# Altium schematic sheet logi-cam-top.SchDoc: PMOD Camera Adapter
size A; Engineer: Michael Jones; DocumentNumber: 1; Revision: RA.1; SheetNumber: 1; SheetTotal: 2; ProjectName: OV7725
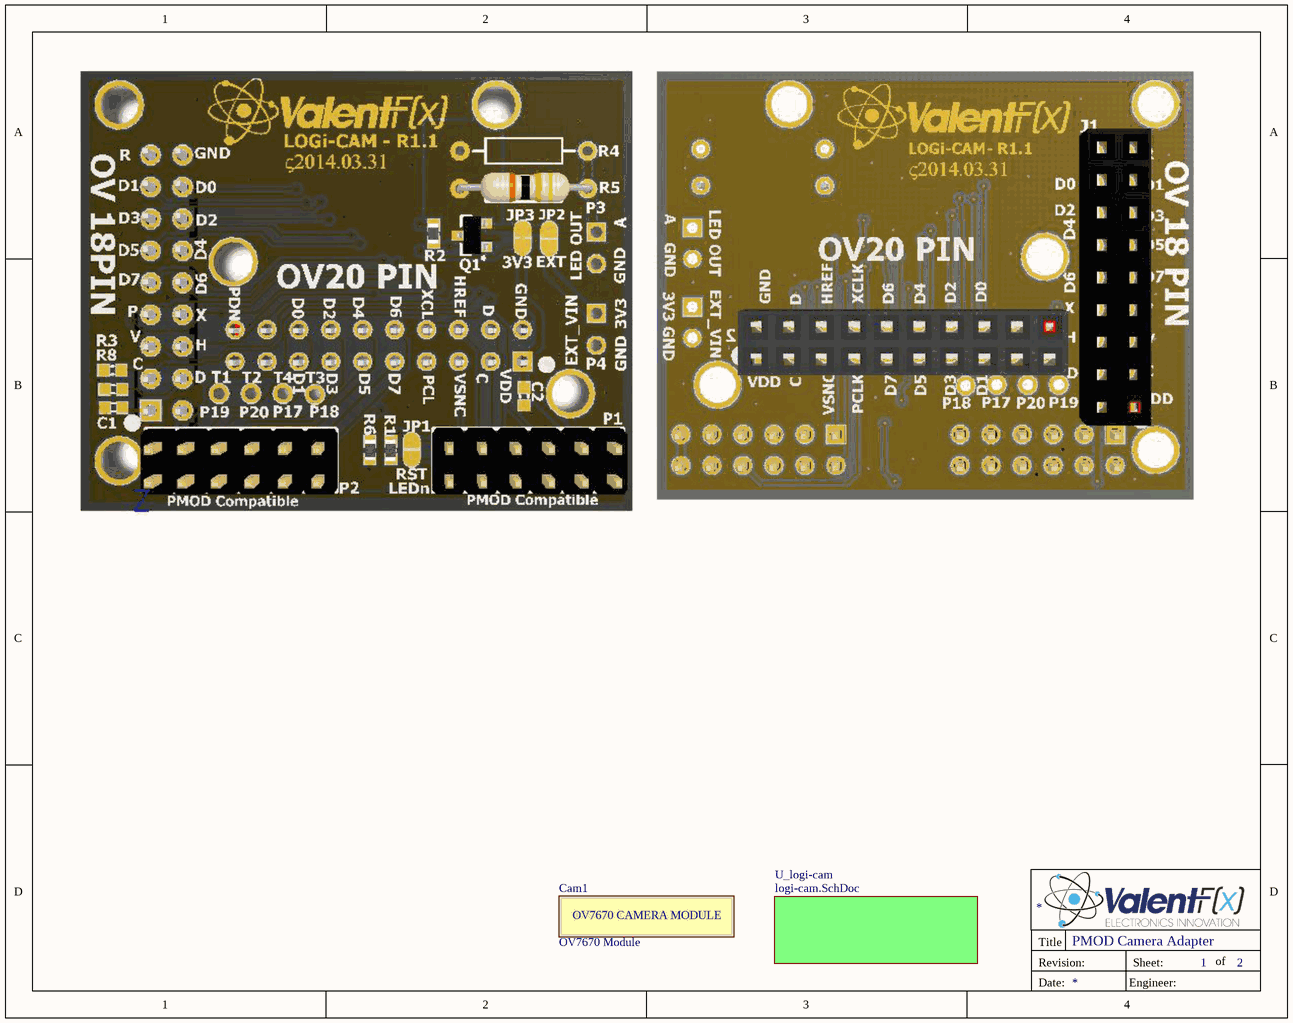
[diagram p0: logi-cam-top.SchDoc]

## Parts
Cam1  OV7670 Module  (mechanical)

## Sub-sheets
U_logi-cam = logi-cam.SchDoc: no entries

## Notes on the sheet
- Title
- Revision:
- Sheet:
- of
- Date:
- Engineer:
- (in symbol OV7670 - Module) OV7670 CAMERA MODULE

## Library data of the parts
Cam1 = OV7670 - Module: OV7670 Camera Module; Supplier 1: http://guangshunsz.en.alibaba.com/product/1477353955-220119761/OV7670_Arduino_Camera_Module_for_collect_photograph_for_arduino_module_for_Arduino_Module_Board.html; Supplier Link 2: http://guangshunsz.en.alibaba.com/; Value: OV7670 Module; Price: 1x 5.40, 100x 5.14